# EAGLE design main (EAGLE 8.7.0)
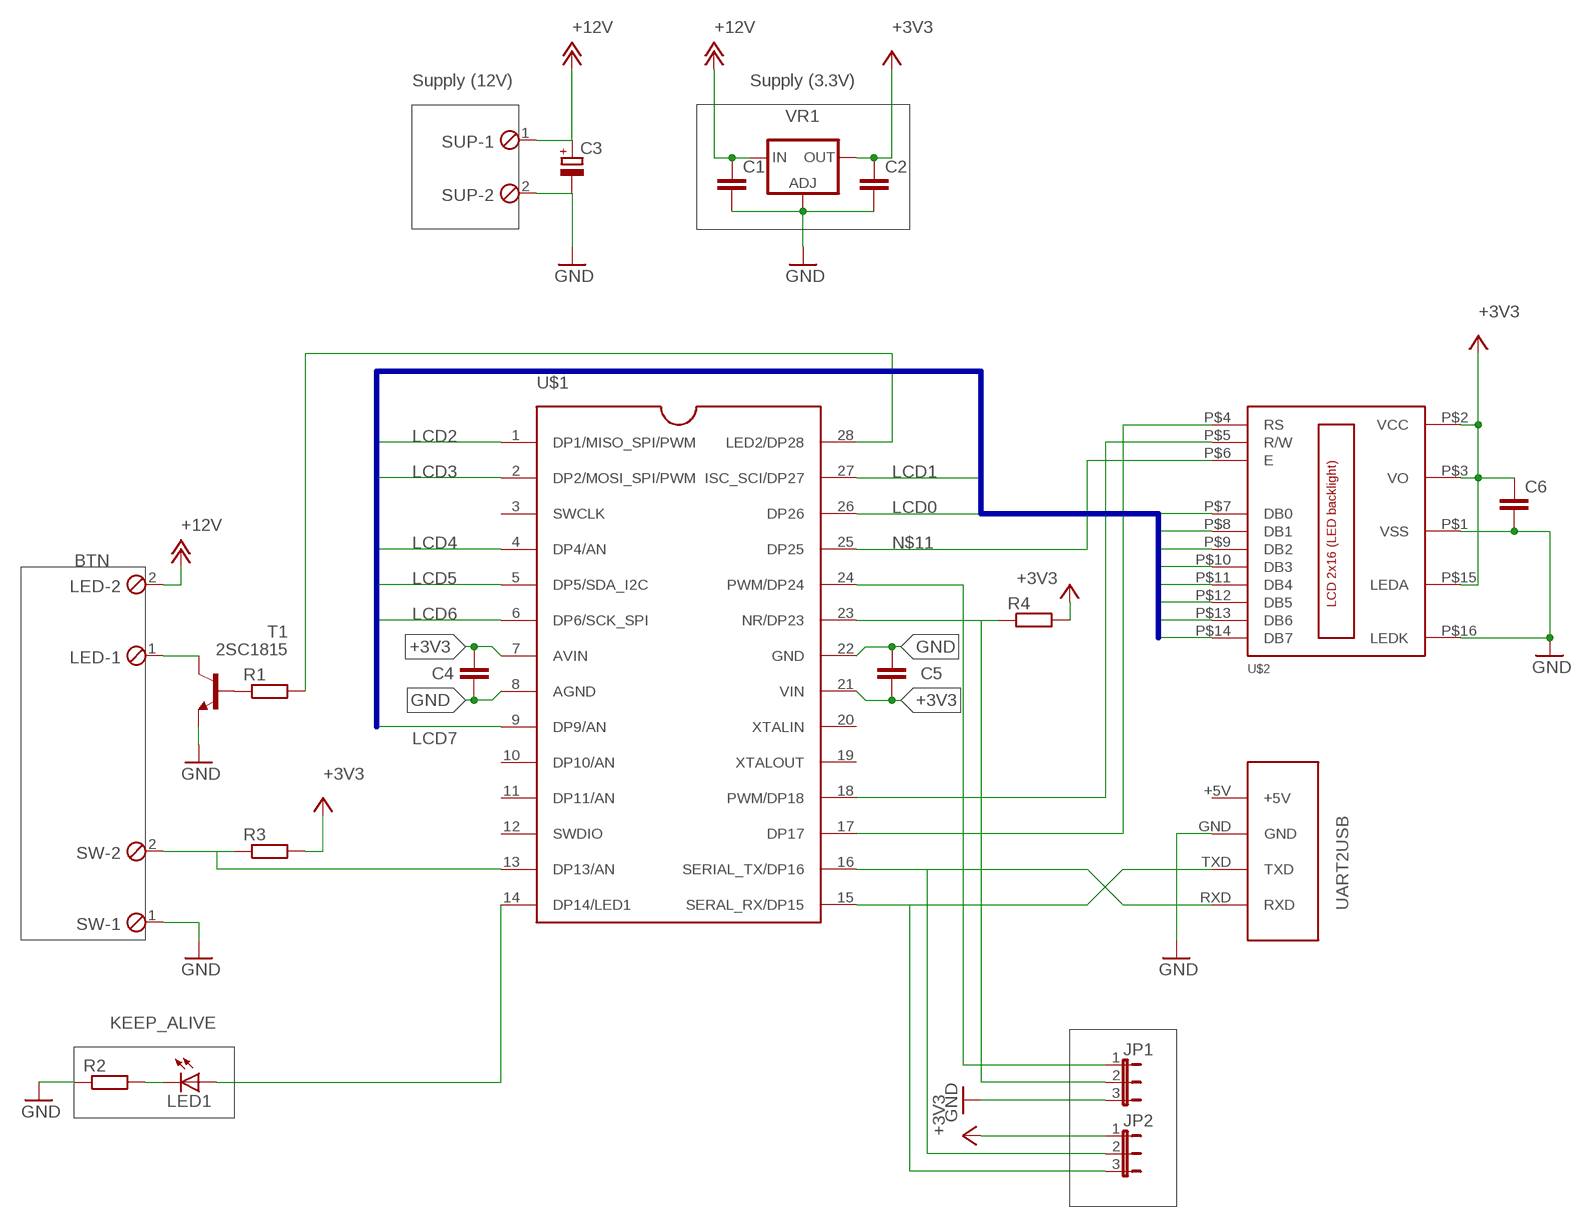
[diagram p0: schematic, sheet 1]

## Parts
C1  C-EUC2012  [C2012]
C2  C-EUC3216  [C3216]
C3  CPOL-EUE2-5  [E2-5]
C4  C-EUC2012  [C2012]
C5  C-EUC2012  [C2012]
C6  C-EUC2012  [C2012]
JP1  JP2E  [JP2]
JP2  JP2E  [JP2]
LED  MPT2  [2POL254]
LED1  LED3MM  [LED3MM]
R1  R-EU_0207/10  [0207/10]
R2  R-EU_R2012  [R2012]
R3  R-EU_0204/7  [0204/7]
R4  R-EU_R2012  [R2012]
SUP  MPT2  [2POL254]
SW  MPT2  [2POL254]
T1  2SC1815  [TO92-ECB]
U$1  LPC1114FDH28  [TSSOP28]
U$2  LCD_2X16_CON2  [16X1_DIP]
UART2USB  USB2UART  [USB2UART]
VR1  LD117ADT33TR  [DPACK]

## Nets
+3V3: C2.1 C4.1 C5.2 C6.1 JP2.1 R3.2 R4.2 U$1.7(AVIN) U$1.21(VIN) U$2.P$2(VCC) U$2.P$3(VO) U$2.P$15(LEDA) VR1.4(OUT)
+12V: C1.1 C3.+ LED.2 SUP.1 VR1.3(IN)
GND: C1.2 C2.2 C3.- C4.2 C5.1 C6.2 JP1.3 R2.1 SUP.2 SW.1 T1.E U$1.8(AGND) U$1.22(GND) U$2.P$1(VSS) U$2.P$16(LEDK) UART2USB.GND VR1.1(ADJ)
LCD0: U$1.26(DP26) U$2.P$7(DB0)
LCD1: U$1.27(ISC_SCI/DP27) U$2.P$8(DB1)
LCD2: U$1.1(DP1/MISO_SPI/PWM) U$2.P$9(DB2)
LCD3: U$1.2(DP2/MOSI_SPI/PWM) U$2.P$10(DB3)
LCD4: U$1.4(DP4/AN) U$2.P$11(DB4)
LCD5: U$1.5(DP5/SDA_I2C) U$2.P$12(DB5)
LCD6: U$1.6(DP6/SCK_SPI) U$2.P$13(DB6)
LCD7: U$1.9(DP9/AN) U$2.P$14(DB7)
N$1: R3.1 SW.2 U$1.13(DP13/AN)
N$2: JP2.3 U$1.15(SERAL_RX/DP15) UART2USB.TXD
N$3: JP2.2 U$1.16(SERIAL_TX/DP16) UART2USB.RXD
N$4: LED1.A U$1.14(DP14/LED1)
N$5: LED.1 T1.C
N$6: R1.1 T1.B
N$7: LED1.K(C) R2.2
N$8: R1.2 U$1.28(LED2/DP28)
N$9: JP1.2 R4.1 U$1.23(NR/DP23)
N$10: JP1.1 U$1.24(PWM/DP24)
N$11: U$1.25(DP25) U$2.P$6(E)
N$12: U$1.18(PWM/DP18) U$2.P$5(R/W)
N$14: U$1.17(DP17) U$2.P$4(RS)
Unconnected: U$1.3(SWCLK) U$1.10(DP10/AN) U$1.11(DP11/AN) U$1.12(SWDIO) U$1.19(XTALOUT) U$1.20(XTALIN) UART2USB.+5V

## Buses
LCD[0..7]

## Notes on the sheet
- Supply (12V) | Supply (3.3V)
- BTN
- KEEP_ALIVE

## Library data of the parts
C1 C2 C4-C6 = rcl:C-EU: CAPACITOR, European symbol
C3 = rcl:CPOL-EU: POLARIZED CAPACITOR, European symbol
JP1 JP2 = jumper:JP2E: JUMPER
LED SUP SW = con-phoenix-254:MPT2: PHOENIX CONNECTOR; OC_FARNELL: unknown; OC_NEWARK: unknown
LED1 = LED:LED: LED OSRAM: - CHIPLED LG R971, LG N971, LY N971, LG Q971, LY Q971, LO R971, LY R971 LH N974, LH R974 LS Q976, LO Q976, LY Q976 LO Q996 - Hyper CHIPLED LW Q18S LB Q993, LB Q99A, LB R99A - SideLED LS A670, LO A670, LY A670, LG A670, LP A670 LB A673, LV A673, LT A673, LW A673 LH A674 LY A675 LS A676, LA A676, LO A676, LY A676, LW A676 LS A679, LY A679, LG A679 - Hyper Micro SIDELED® LS Y876, LA Y876, LO Y876, LY Y876 LT Y87S - SmartLED LW L88C, LW L88S LB L89C, LB L89S, LG L890 LS L89K, LO L89K, LY L89K LS L896, LA L896, LO L896, LY L896 - TOPLED LS T670, LO T670, LY T670, LG T670, LP T670 LSG T670, LSP T670, LSY T670, LOP T670, LYG T670 LG T671, LOG T671, LSG T671 LB T673, LV T673, LT T673, LW T673 LH T674 LS T676, LA T676, LO T676, LY T676, LB T676, LH T676, LSB T676, LW T676 LB T67C, LV T67C, LT T67C, LS T67K, LO T67K, LY T67K, LW E67C LS E67B, LA E67B, LO E67B, LY E67B, LB E67C, LV E67C, LT E67C LW T67C LS T679, LY T679, LG T679 LS T770, LO T770, LY T770, LG T770, LP T770 LB T773, LV T773, LT T773, LW T773 LH T774 LS E675, LA E675, LY E675, LS T675 LS T776, LA T776, LO T776, LY T776, LB T776 LHGB T686 LT T68C, LB T68C - Hyper Mini TOPLED® LB M676 - Mini TOPLED Santana® LG M470 LS M47K, LO M47K, LY M47K Source: http://www.osram.convergy.de LUXEON: - LUMILED® LXK2-PW12-R00, LXK2-PW12-S00, LXK2-PW14-U00, LXK2-PW14-V00 LXK2-PM12-R00, LXK2-PM12-S00, LXK2-PM14-U00 LXK2-PE12-Q00, LXK2-PE12-R00, LXK2-PE12-S00, LXK2-PE14-T00, LXK2-PE14-U00 LXK2-PB12-K00, LXK2-PB12-L00, LXK2-PB12-M00, LXK2-PB14-N00, LXK2-PB14-P00, LXK2-PB14-Q00 LXK2-PR12-L00, LXK2-PR12-M00, LXK2-PR14-Q00, LXK2-PR14-R00 LXK2-PD12-Q00, LXK2-PD12-R00, LXK2-PD12-S00 LXK2-PH12-R00, LXK2-PH12-S00 LXK2-PL12-P00, LXK2-PL12-Q00, LXK2-PL12-R00 Source: www.luxeon.com KINGBRIGHT: KA-3528ASYC Source: www.kingbright.com
R1-R4 = rcl:R-EU_: RESISTOR, European symbol
T1 = transistor:2SC1815: NPN EPITAXIAL TRANSISTOR Source: TOSHIBA .. 2SC1815 1.pdf
U$1 = lpc1114fn28:LPC1114FDH28
U$2 = lcd_2x16_led_backlight:LCD_2X16_CON2
UART2USB = USBtoUART_module(M-08461):USB2UART
VR1 = v-reg:LD117A?*: Low drop fixed and adjustable positive voltage regulators 1 A Source: http://www.st.com/stonline/products/literature/ds/7194/ld1117axx.pdf

## Board
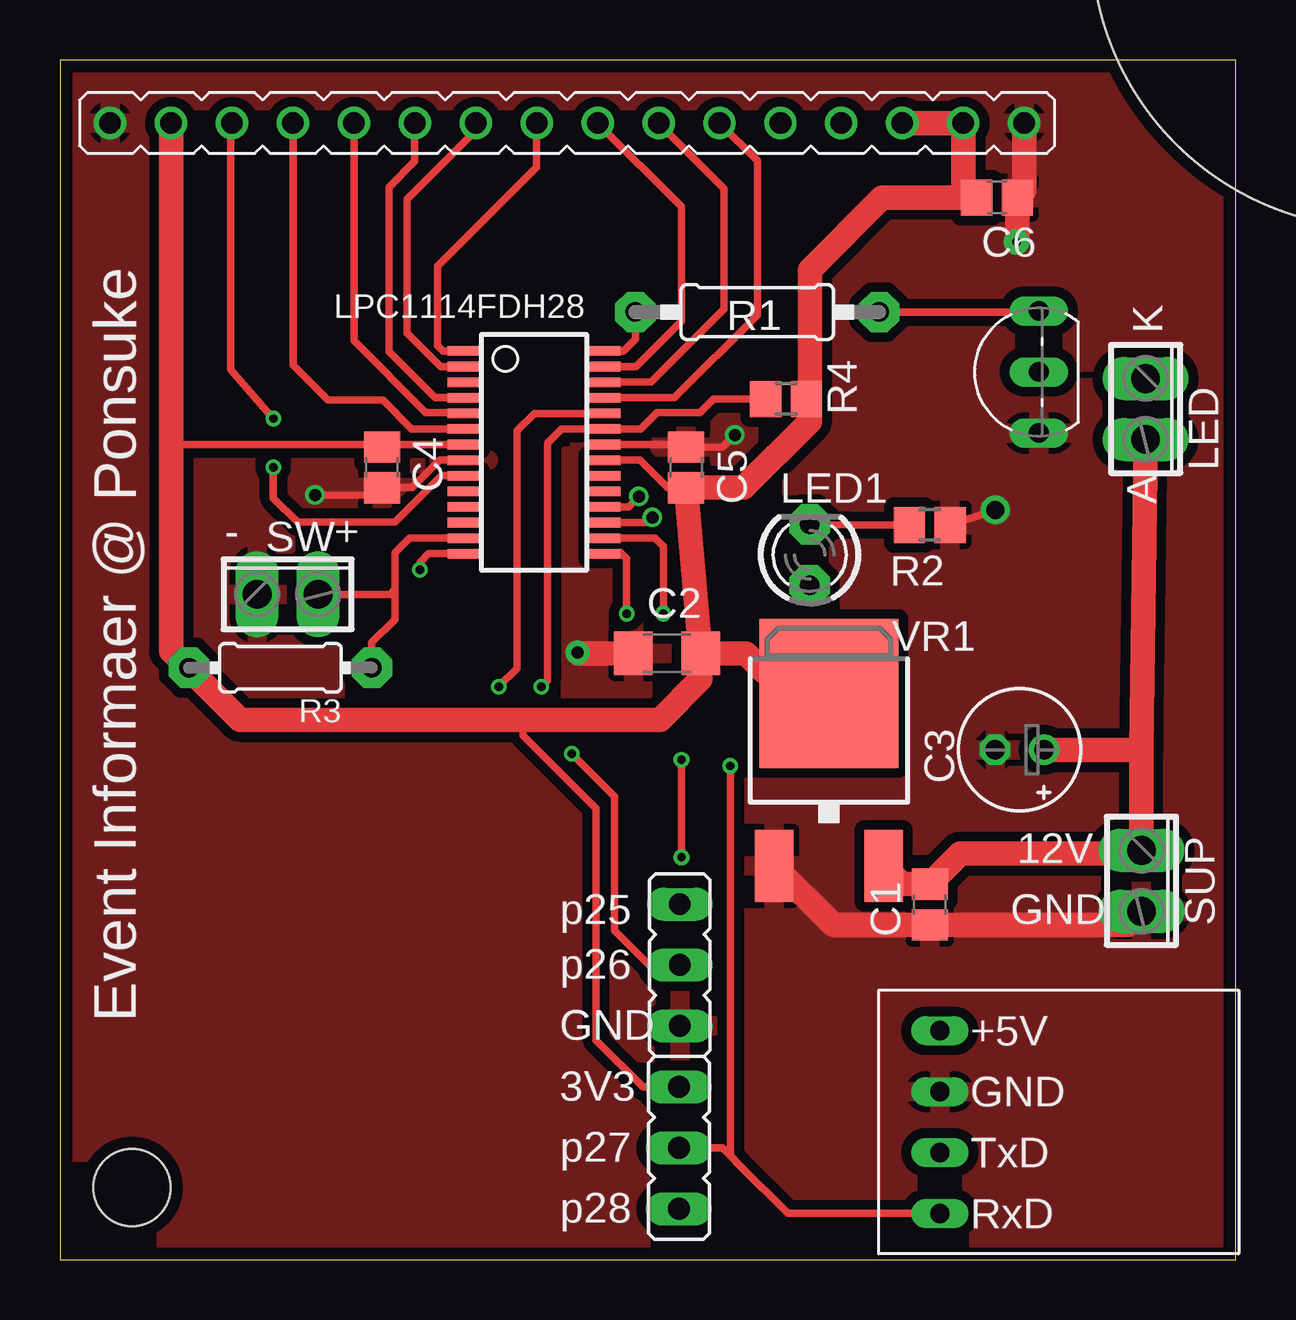
[diagram p1: board, top side]
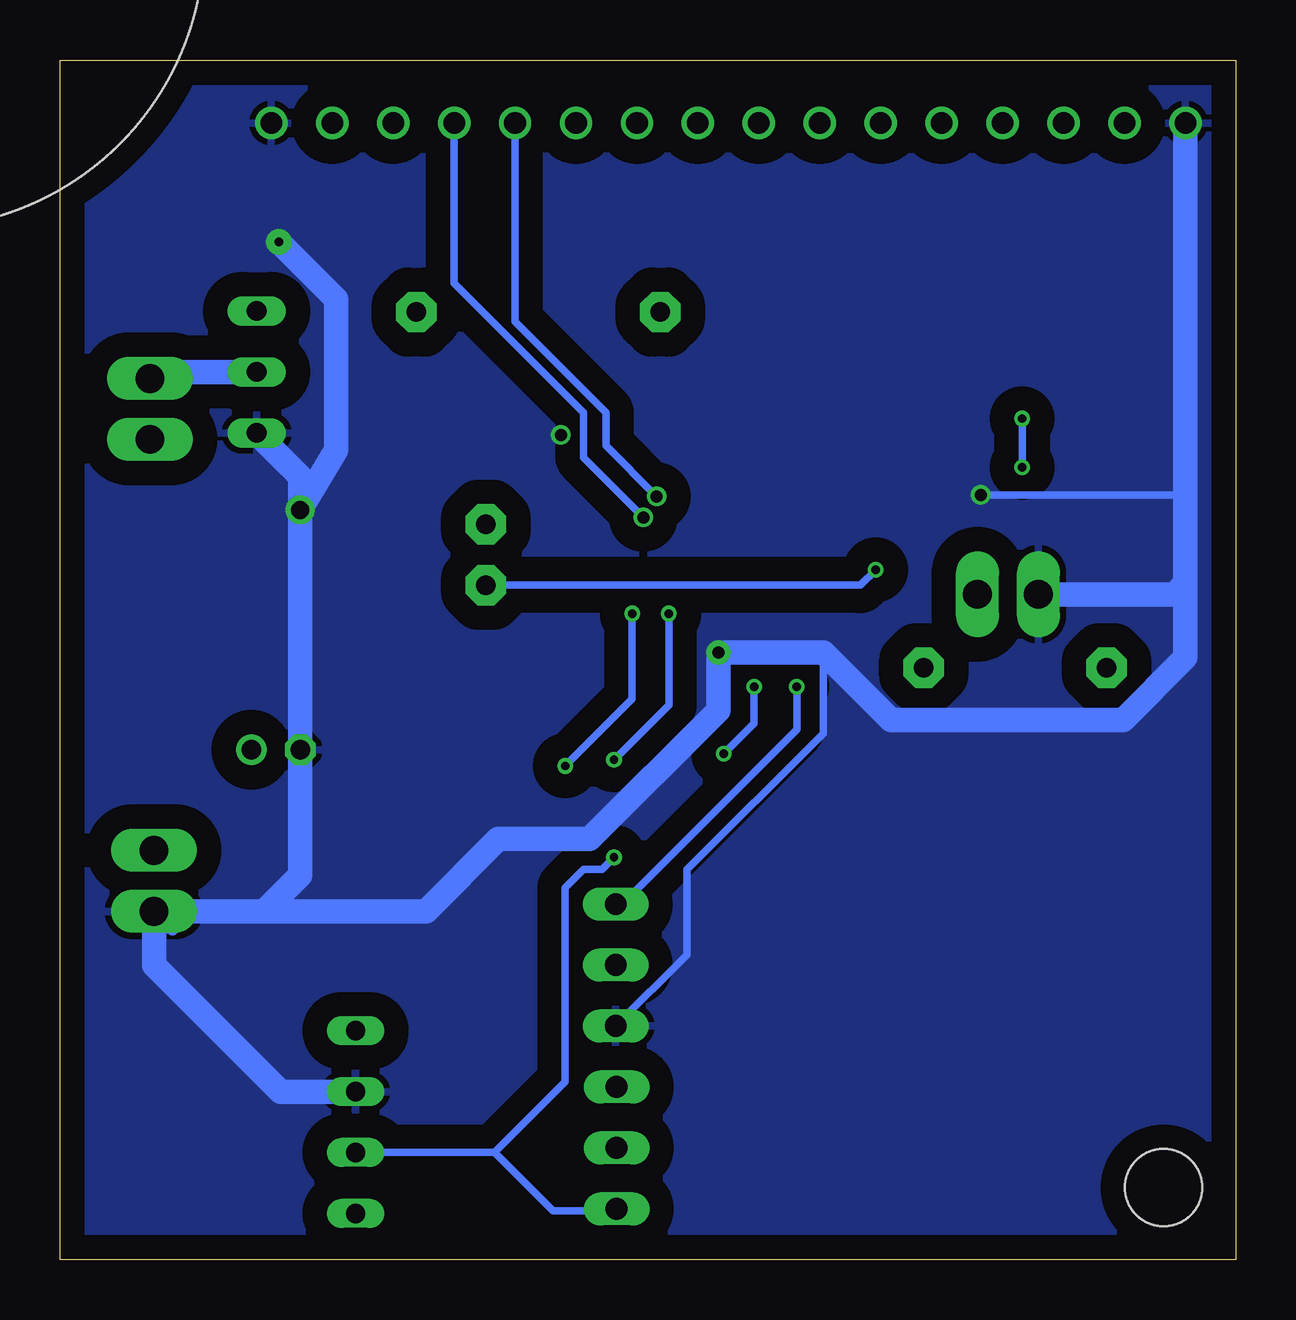
[diagram p2: board, bottom side, seen from below]

Size 49 x 50 mm. Coordinates in mm from the lower left corner, seen from the top.
Outline: 0,0 49,0 49,50 0,50 0,0
Copper layers (1*16): Top 0.035mm / dielectric 1.6mm / Bottom 0.035mm
Design rules "Elecrow_2-layer_PCB_eagle_rule": minimum track width 6mil, minimum drill 12mil, track to track 6mil, track to pad 6mil, pad to pad 6mil, via to via 8mil, smd to smd 0mil, copper to edge 20mil, drill to drill 10mil, minimum pad ring 6mil, minimum via ring 6mil, stop-mask expansion 0mil, vias tented up to drill 100mil, thermal gap 10mil
Holes 24 mm at 55,55
Holes 3.2 mm at 3,3

### Footprints (pad centres in the part's own frame; a part is rotated, then mirrored left to right if it is on the bottom)
C2012 = smd 1.3 x 1.5: 1 -0.85,0; 2 0.85,0
C3216 = smd 1.6 x 1.8: 1 -1.4,0; 2 1.4,0
E2-5 = drill 0.813 pad 1.27: + -1.016,0 | drill 0.813 pad 1.27 octagon: - 1.016,0
JP2 = drill 0.914 long: 1 -2.54,0; 2 0,0; 3 2.54,0
2POL254 = drill 1.2 long: 1 -1.27,0; 2 1.27,0
LED3MM = drill 0.813 pad 1.676 octagon: A -1.27,0; K 1.27,0
0207/10 = drill 0.813 pad 1.676 octagon: 1 -5.08,0; 2 5.08,0
R2012 = smd 1.3 x 1.5: 1 -0.85,0; 2 0.85,0
0204/7 = drill 0.813 pad 1.676 octagon: 1 -3.81,0; 2 3.81,0
TO92-ECB = drill 0.813 long: B 2.54,0; C 0,0; E -2.54,0
TSSOP28 = smd 0.4 x 1.35: 1 -4.225,-2.925; 2 -3.575,-2.925; 3 -2.925,-2.925; 4 -2.275,-2.925; 5 -1.625,-2.925; 6 -0.975,-2.925; 7 -0.325,-2.925; 8 0.325,-2.925; 9 0.975,-2.925; 10 1.625,-2.925; 11 2.275,-2.925; 12 2.925,-2.925; 13 3.575,-2.925; 14 4.225,-2.925; 15 4.225,2.925; 16 3.575,2.925; 17 2.925,2.925; 18 2.275,2.925; 19 1.625,2.925; 20 0.975,2.925; 21 0.325,2.925; 22 -0.325,2.925; 23 -0.975,2.925; 24 -1.625,2.925; 25 -2.275,2.925; 26 -2.925,2.925; 27 -3.575,2.925; 28 -4.225,2.925
16X1_DIP = drill 0.9: P$1 -19.05,0; P$2 -16.51,0; P$3 -13.97,0; P$4 -11.43,0; P$5 -8.89,0; P$6 -6.35,0; P$7 -3.81,0; P$8 -1.27,0; P$9 1.27,0; P$10 3.81,0; P$11 6.35,0; P$12 8.89,0; P$13 11.43,0; P$14 13.97,0; P$15 16.51,0; P$16 19.05,0
USB2UART = drill 0.8 long: +5V -3.81,2.54; GND -1.27,2.54; RXD 3.81,2.54; TXD 1.27,2.54
DPACK = smd 1.6 x 3: 1 -2.28,-4.8; 3 2.28,-4.8 | smd 5.8 x 6.2: 4 0,2.38

### Placement (x,y rotation side)
C1  36.25,14.8 270 top
C2  25.3,25.27 180 top
C3  40,21.25 180 top
C4  13.42,33.02 270 top
C5  26.1,33.02 270 top
C6  39.05,44.27 0 top
JP1  25.83,12.27 270 top
JP2  25.8,4.65 270 top
LED  45.25,35.45 270 top
LED1  31.25,29.38 90 top
R1  29.06,39.49 180 top
R2  36.25,30.62 180 top
R3  9.19,24.67 180 top
R4  30.27,35.87 0 top
SUP  45.08,15.79 270 top
SW  9.49,27.73 0 top
T1  40.8,36.99 90 top
U$1  19.76,33.65 270 top
U$2  21.14,47.38 180 top
UART2USB  34.13,5.73 270 top
VR1  32.05,21.21 0 top

### Tracks (layer width: path | path; a pad name or v marks a point on that pad's centre or on a via)
+3V3
  Top 0.305: U$1.21 24.18,33.32 25.33,32.17 C5.2 | C4.1 13.52,33.97 U$1.7 4.85,33.97 4.63,33.75 | R3.2 5.06,25.37 4.63,25.37 | JP2.1 24.3,7.19 22.35,9.14 22.35,18.8 19.3,21.84 19.3,22.5 | R4.2 31.17,35.81 31.25,35.81
  Top 1.016: C5.2 26.22,32.05 | C5.2 C2.1 | U$2.P$15 4.63,33.75 4.63,25.37 7.5,22.5 19.3,22.5 25,22.5 26.7,24.2 C2.1 | U$2.P$3 U$2.P$2 37.65,44.82 C6.1 34.27,44.27 31.25,41.25 31.25,35.81 31.25,34.92 28.5,32.17 C5.2 | C2.1 28.59,25.27 30.27,23.59 VR1.4
+12V
  Top 1.016: 45.08,21.27 SUP.1 44.95,16.92 37.52,16.92 C1.1 35.09,15.65 VR1.3 | 45.08,21.27 LED.2 | C3.+ 45.05,21.25 45.08,21.27
GND  (via drill 0.35 pad 1.05, 0.5, 0.5 pad 1, 0.75 pad 1.2)
  Top 0.305: U$1.22 26,33.97 C5.1 27.62,33.87 v28.12,34.38 | U$1.8 15.82,33.32 14.67,32.17 C4.2 13.12,31.88 v10.62,31.88 | R2.1 v38.98,31.25
  Top 1.016: U$2.P$1 40.19,44.55 C6.2 39.91,42.45 v39.88,42.42 | v21.56,25.31 21.61,25.27 C2.2 | VR1.1 32.23,13.95 C1.2 44.52,13.95 SUP.2
  Bottom 0.305: v10.62,31.88 2.09,31.88 | JP1.3 22.86,12.71 22.86,16.26 17.19,21.93 17.19,25.31
  Bottom 0.508: 44.31,13.75 SUP.2
  Bottom 1.016: v38.98,31.25 C3.- 38.98,16.02 40.48,14.52 | v38.98,31.25 37.5,33.75 37.5,40.04 v39.88,42.42 | U$2.P$16 2.09,31.88 2.09,28.19 | UART2USB.GND 39.81,7 45.08,12.27 SUP.2 40.64,14.52 40.48,14.52 | 2.09,28.19 2.09,25.1 4.69,22.5 14.38,22.5 17.19,25.31 v21.56,25.31 21.56,22.89 26.92,17.53 30.73,17.53 33.74,14.52 40.48,14.52 | SW.1 2.56,27.73 2.09,28.19 | T1.E 38.98,32.63 v38.98,31.25
  pour Bottom (isolate 1.016, rank 2): -0.62,50.62 -0.62,-0.31 49.69,-0.31 49.69,50.31
  pour Top (isolate 0.406, rank 2): 0,50 49.06,50 49.06,0 0,0
LCD0
  Top 0.305: U$1.26 24.63,36.57 27.69,39.62 27.69,44.64 U$2.P$7
LCD1
  Top 0.305: U$1.27 24.01,37.22 25.91,39.12 25.91,43.88 U$2.P$8
LCD2
  Top 0.305: U$1.1 15.98,37.87 15.75,38.1 15.75,41.4 19.87,45.52 U$2.P$9
LCD3
  Top 0.305: U$1.2 15.87,37.22 14.48,38.61 14.48,44.2 17.33,47.05 U$2.P$10
LCD4
  Top 0.305: U$1.4 15.64,35.92 13.72,37.85 13.72,44.7 14.79,45.78 U$2.P$11
LCD5
  Top 0.305: U$1.5 16.8,35.31 15.24,35.31 12.25,38.3 U$2.P$12
LCD6
  Top 0.305: U$1.6 14.66,34.62 13.46,35.81 11.18,35.81 9.71,37.28 U$2.P$13
LCD7  (via drill 0.35)
  Top 0.305: U$1.9 15.91,32.67 13.97,30.73 9.91,30.73 8.89,31.75 v8.89,33.02 | v8.89,35.05 7.11,37.08 7.11,47.32 U$2.P$14
  Bottom 0.305: v8.89,33.02 v8.89,35.05
N$1
  Top 0.305: 13.97,27.94 13.97,29.46 14.58,30.07 U$1.13 | 13.97,27.94 13.97,26.68 13,25.71 R3.1 | SW.2 13.76,27.73 13.97,27.94
N$2  (via drill 0.35)
  Top 0.305: v25.91,16.76 v25.91,20.83 | v23.62,26.92 23.62,29.21 23.37,29.46 23.32,29.42 U$1.15
  Bottom 0.305: UART2USB.TXD 30.88,4.46 | 30.88,4.46 28.45,2.03 25.88,2.03 JP2.3 | 30.88,4.46 27.94,7.4 27.94,15.49 27.18,16.26 26.42,16.26 v25.91,16.76 | v25.91,20.83 23.62,23.11 v23.62,26.92
N$3  (via drill 0.35)
  Top 0.305: JP2.2 27.61,4.65 27.94,4.32 | UART2USB.RXD 30.34,1.92 28.32,3.94 27.94,4.32 | U$1.16 24.79,30.07 25.15,29.72 v25.15,26.92 | v27.94,20.57 27.94,4.32
  Bottom 0.305: v25.15,26.92 25.15,23.37 v27.94,20.57
N$4  (via drill 0.35)
  Top 0.305: U$1.14 15.36,29.42 15,29.06 v15,28.75
  Bottom 0.305: v15,28.75 15.64,28.11 LED1.A
N$5
  Bottom 1.016: T1.C 44.99,36.99 LED.1
N$6
  Top 0.305: R1.1 40.76,39.49 T1.B
N$7
  Top 0.305: LED1.K 32.88,30.62 R2.2
N$8
  Top 0.305: U$1.28 23.5,37.87 23.98,38.36 R1.2
N$9  (via drill 0.35)
  Top 0.305: v20.07,23.88 20.32,24.13 20.32,34.04 20.9,34.62 U$1.23 24.21,34.62 24.89,35.31 26.67,35.31 27.23,35.87 R4.1 | v21.34,21.08 23.11,19.3 23.11,13.72 24.56,12.27 JP1.2
  Bottom 0.305: v20.07,23.88 20.07,22.35 v21.34,21.08
N$10  (via drill 0.35)
  Top 0.305: U$1.24 19.78,35.27 19.05,34.54 19.05,24.64 v18.29,23.88
  Bottom 0.305: v18.29,23.88 18.29,22.1 25.57,14.81 JP1.1
N$11
  Top 0.305: U$2.P$6 29.06,45.8 29.06,39.38 25.61,35.92 U$1.25
N$12  (via drill 0.5)
  Top 0.305: U$1.18 23.69,31.37 v24.13,31.81
  Bottom 0.305: v24.13,31.81 26.25,33.93 26.25,35.31 30.03,39.09 U$2.P$5
N$14  (via drill 0.5)
  Top 0.305: U$1.17 24.47,30.72 v24.69,30.94
  Bottom 0.305: v24.69,30.94 27.19,33.44 27.19,35.31 32.57,40.7 U$2.P$4

### Text on the board
tNames: K | A | - | + | 12V | p25 | GND | p26 | Event Informaer @ Ponsuke | GND | 3V3 | p27 | p28